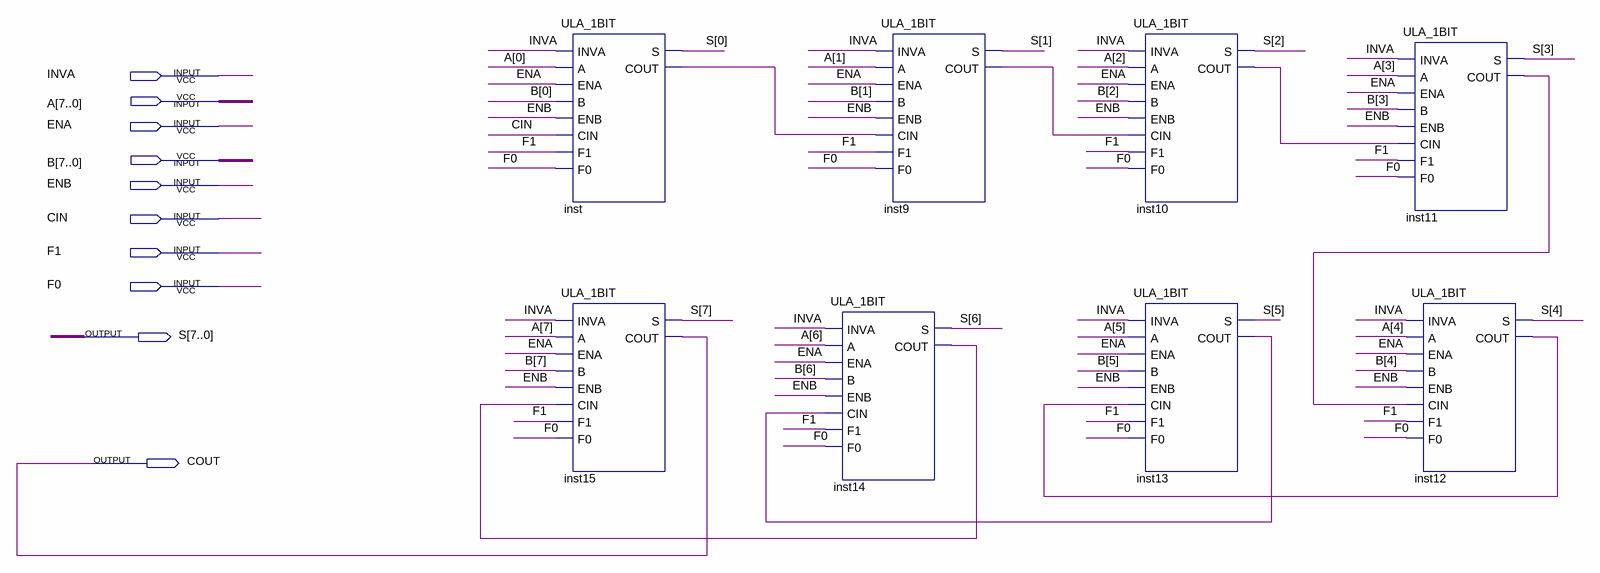
[diagram p0: schematic sheet]
// Quartus schematic ULA_8BIT.bdf as structural Verilog: 8 symbols, 10 pins
module ULA_8BIT (
  input  INVA,
  input  [7:0] A,
  input  ENA,
  input  [7:0] B,
  input  ENB,
  input  CIN,
  input  F1,
  input  F0,
  output [7:0] S,
  output COUT
);

  wire inst9_cout, inst10_cout, inst11_cout, inst12_cout, inst13_cout, inst14_cout, inst_cout;

  ULA_1BIT inst (
    .INVA(INVA), .A(A[0]), .ENA(ENA), .B(B[0]), .ENB(ENB), .CIN(CIN), .F1(F1), .F0(F0), .S(S[0]),
    .COUT(inst_cout));
  ULA_1BIT inst15 (
    .INVA(INVA), .A(A[7]), .ENA(ENA), .B(B[7]), .ENB(ENB), .CIN(inst14_cout), .F1(F1), .F0(F0), .S(S[7]),
    .COUT(COUT));
  ULA_1BIT inst9 (
    .INVA(INVA), .A(A[1]), .ENA(ENA), .B(B[1]), .ENB(ENB), .CIN(inst_cout), .F1(F1), .F0(F0), .S(S[1]),
    .COUT(inst9_cout));
  ULA_1BIT inst14 (
    .INVA(INVA), .A(A[6]), .ENA(ENA), .B(B[6]), .ENB(ENB), .CIN(inst13_cout), .F1(F1), .F0(F0), .S(S[6]),
    .COUT(inst14_cout));
  ULA_1BIT inst10 (
    .INVA(INVA), .A(A[2]), .ENA(ENA), .B(B[2]), .ENB(ENB), .CIN(inst9_cout), .F1(F1), .F0(F0), .S(S[2]),
    .COUT(inst10_cout));
  ULA_1BIT inst13 (
    .INVA(INVA), .A(A[5]), .ENA(ENA), .B(B[5]), .ENB(ENB), .CIN(inst12_cout), .F1(F1), .F0(F0), .S(S[5]),
    .COUT(inst13_cout));
  ULA_1BIT inst11 (
    .INVA(INVA), .A(A[3]), .ENA(ENA), .B(B[3]), .ENB(ENB), .CIN(inst10_cout), .F1(F1), .F0(F0), .S(S[3]),
    .COUT(inst11_cout));
  ULA_1BIT inst12 (
    .INVA(INVA), .A(A[4]), .ENA(ENA), .B(B[4]), .ENB(ENB), .CIN(inst11_cout), .F1(F1), .F0(F0), .S(S[4]),
    .COUT(inst12_cout));
endmodule
